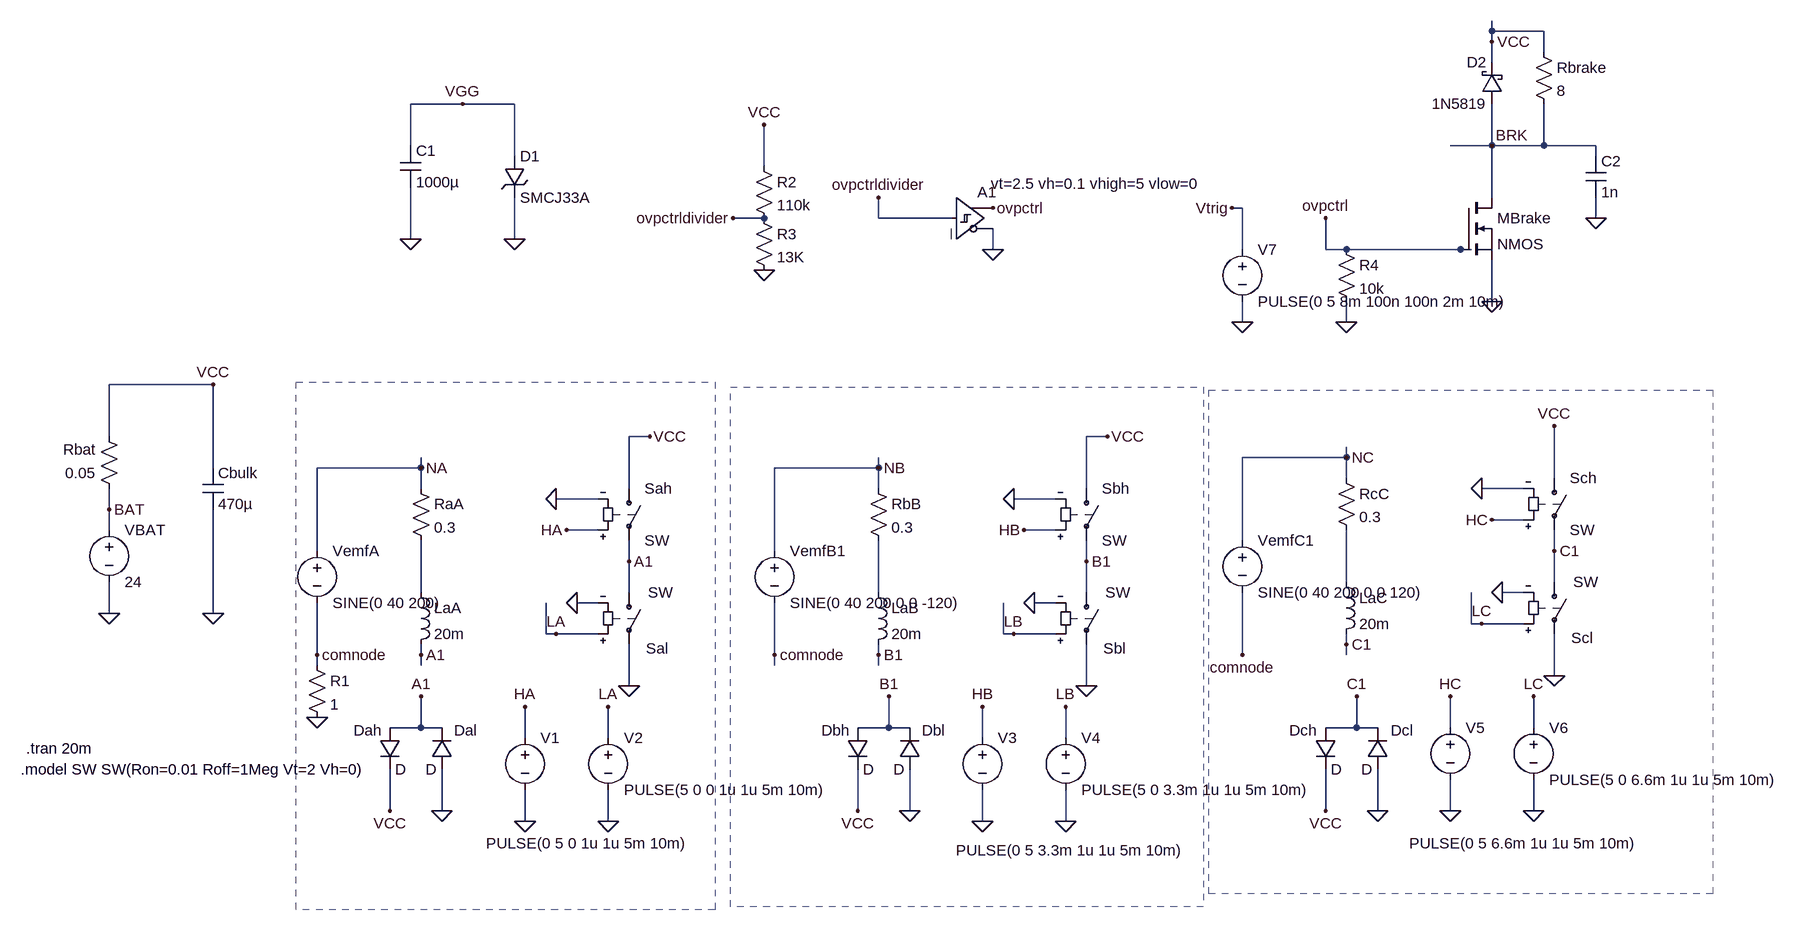
[diagram p0: schematic motor_load.asc]
motor_load.asc, the LTspice schematic file:
Version 4
SHEET 1 2236 912
WIRE 1440 -784 1440 -800
WIRE 1520 -784 1440 -784
WIRE 1440 -768 1440 -784
WIRE 1520 -752 1520 -784
WIRE 1440 -736 1440 -768
WIRE -144 -672 -224 -672
WIRE -64 -672 -144 -672
WIRE -224 -608 -224 -672
WIRE 1440 -608 1440 -672
WIRE 1440 -608 1376 -608
WIRE 1520 -608 1520 -672
WIRE 1520 -608 1440 -608
WIRE 1600 -608 1520 -608
WIRE -64 -592 -64 -672
WIRE 1600 -592 1600 -608
WIRE 320 -576 320 -640
WIRE 1440 -528 1440 -608
WIRE 1056 -512 1040 -512
WIRE 320 -496 272 -496
WIRE 496 -496 496 -528
WIRE 608 -496 496 -496
WIRE 1600 -496 1600 -528
WIRE -224 -464 -224 -544
WIRE -64 -464 -64 -528
WIRE 672 -448 672 -480
WIRE 1056 -448 1056 -512
WIRE 1184 -448 1184 -496
WIRE 1216 -448 1184 -448
WIRE 1392 -448 1216 -448
WIRE 1408 -448 1392 -448
WIRE 1440 -368 1440 -432
WIRE 1056 -336 1056 -368
WIRE 1216 -336 1216 -368
WIRE -528 -240 -688 -240
WIRE -688 -160 -688 -240
WIRE 144 -160 112 -160
WIRE 848 -160 816 -160
WIRE 1216 -128 1216 -144
WIRE 1216 -128 1056 -128
WIRE -528 -112 -528 -240
WIRE -208 -112 -208 -128
WIRE -208 -112 -368 -112
WIRE 496 -112 496 -128
WIRE 496 -112 336 -112
WIRE 1216 -96 1216 -128
WIRE 1536 -96 1536 -176
WIRE -208 -80 -208 -112
WIRE 112 -80 112 -160
WIRE 496 -80 496 -112
WIRE 816 -80 816 -160
WIRE 1488 -80 1424 -80
WIRE 64 -64 0 -64
WIRE 768 -64 704 -64
WIRE -688 -48 -688 -80
WIRE 1488 -32 1440 -32
WIRE -688 -16 -688 -48
WIRE 64 -16 16 -16
WIRE 768 -16 720 -16
WIRE 1056 0 1056 -128
WIRE -368 16 -368 -112
WIRE 336 16 336 -112
WIRE 1536 16 1536 -16
WIRE 112 32 112 0
WIRE 816 32 816 0
WIRE 1216 64 1216 -16
WIRE 1536 64 1536 16
WIRE -208 80 -208 0
WIRE 112 80 112 32
WIRE 496 80 496 0
WIRE 816 80 816 32
WIRE 1488 80 1456 80
WIRE 64 96 32 96
WIRE 768 96 736 96
WIRE -688 112 -688 64
WIRE -528 112 -528 -48
WIRE 1408 128 1408 80
WIRE 1424 128 1408 128
WIRE 1488 128 1424 128
WIRE -16 144 -16 96
WIRE 0 144 -16 144
WIRE 64 144 0 144
WIRE 688 144 688 96
WIRE 704 144 688 144
WIRE 768 144 704 144
WIRE 1216 160 1216 144
WIRE -368 176 -368 96
WIRE -208 176 -208 160
WIRE 336 176 336 96
WIRE 496 176 496 160
WIRE 1056 176 1056 80
WIRE 1216 176 1216 160
WIRE -368 192 -368 176
WIRE -208 192 -208 176
WIRE 336 192 336 176
WIRE 496 192 496 176
WIRE 1536 208 1536 144
WIRE 112 224 112 160
WIRE 816 224 816 160
WIRE -208 288 -208 240
WIRE -208 288 -256 288
WIRE -176 288 -208 288
WIRE 512 288 512 240
WIRE 512 288 464 288
WIRE 544 288 512 288
WIRE 1232 288 1232 240
WIRE 1232 288 1184 288
WIRE 1264 288 1232 288
WIRE 1376 288 1376 240
WIRE 1504 288 1504 240
WIRE -48 304 -48 256
WIRE 80 304 80 256
WIRE 656 304 656 256
WIRE 784 304 784 256
WIRE -256 416 -256 352
WIRE -176 416 -176 352
WIRE 464 416 464 352
WIRE 544 416 544 352
WIRE 1184 416 1184 352
WIRE 1264 416 1264 352
WIRE 1376 416 1376 368
WIRE 1504 416 1504 368
WIRE -48 432 -48 384
WIRE 80 432 80 384
WIRE 656 432 656 384
WIRE 784 432 784 384
FLAG -528 -240 VCC
FLAG -688 112 0
FLAG -208 176 A1
FLAG -208 -112 NA
FLAG -528 112 0
FLAG -688 -48 BAT
FLAG 144 -160 VCC
FLAG 16 -16 HA
FLAG 0 -64 0
FLAG 112 224 0
FLAG 32 96 0
FLAG 112 32 A1
FLAG 0 144 LA
FLAG -48 432 0
FLAG 80 432 0
FLAG -48 256 HA
FLAG 80 256 LA
FLAG 496 176 B1
FLAG 496 -112 NB
FLAG 848 -160 VCC
FLAG 720 -16 HB
FLAG 704 -64 0
FLAG 816 224 0
FLAG 736 96 0
FLAG 816 32 B1
FLAG 704 144 LB
FLAG 656 432 0
FLAG 784 432 0
FLAG 656 256 HB
FLAG 784 256 LB
FLAG 1216 160 C1
FLAG 1216 -128 NC
FLAG 1440 -32 HC
FLAG 1424 -80 0
FLAG 1536 208 0
FLAG 1456 80 0
FLAG 1536 16 C1
FLAG 1424 128 LC
FLAG 1376 416 0
FLAG 1504 416 0
FLAG 1376 240 HC
FLAG 1504 240 LC
FLAG 1536 -176 VCC
FLAG -368 176 comnode
FLAG 336 176 comnode
FLAG 1056 176 comnode
FLAG -368 272 0
FLAG 272 -496 ovpctrldivider
FLAG 320 -640 VCC
FLAG 320 -416 0
FLAG 672 -448 0
FLAG 496 -528 ovpctrldivider
FLAG 672 -512 ovpctrl
FLAG -224 -464 0
FLAG -64 -464 0
FLAG -144 -672 VGG
FLAG 1440 -368 0
FLAG 1216 -336 0
FLAG 1440 -608 BRK
FLAG 1600 -496 0
FLAG 1440 -768 VCC
FLAG -208 240 A1
FLAG -256 416 VCC
FLAG -176 416 0
FLAG 512 240 B1
FLAG 464 416 VCC
FLAG 544 416 0
FLAG 1232 240 C1
FLAG 1184 416 VCC
FLAG 1264 416 0
FLAG 1040 -512 Vtrig
FLAG 1056 -336 0
FLAG 1184 -496 ovpctrl
SYMBOL Ind -224 64 R0
SYMATTR InstName LaA
SYMATTR Value 20m
SYMBOL Voltage -688 -32 R0
SYMATTR InstName VBAT
SYMATTR Value 24
SYMBOL Res -224 -96 R0
SYMATTR InstName RaA
SYMATTR Value 0.3
SYMBOL Res -672 -64 R180
WINDOW 0 36 76 Left 2
WINDOW 3 36 40 Left 2
SYMATTR InstName Rbat
SYMATTR Value 0.05
SYMBOL Cap -544 -112 R0
SYMATTR InstName Cbulk
SYMATTR Value 470µ
SYMBOL Voltage -368 0 R0
SYMATTR InstName VemfA
SYMATTR Value SINE(0 40 200)
SYMBOL sw 112 -96 R0
SYMATTR InstName Sah
SYMBOL sw 112 64 R0
WINDOW 0 26 102 Left 2
WINDOW 3 29 16 Left 2
SYMATTR InstName Sal
SYMBOL Voltage -48 288 R0
WINDOW 3 -60 178 Left 2
SYMATTR Value PULSE(0 5 0 1u 1u 5m 10m)
SYMATTR InstName V1
SYMBOL Voltage 80 288 R0
SYMATTR InstName V2
SYMATTR Value PULSE(5 0 0 1u 1u 5m 10m)
SYMBOL Ind 480 64 R0
SYMATTR InstName LaB
SYMATTR Value 20m
SYMBOL Res 480 -96 R0
SYMATTR InstName RbB
SYMATTR Value 0.3
SYMBOL sw 816 -96 R0
SYMATTR InstName Sbh
SYMBOL sw 816 64 R0
WINDOW 0 26 102 Left 2
WINDOW 3 29 16 Left 2
SYMATTR InstName Sbl
SYMBOL Voltage 656 288 R0
WINDOW 3 -41 189 Left 2
SYMATTR Value PULSE(0 5 3.3m 1u 1u 5m 10m)
SYMATTR InstName V3
SYMBOL Voltage 784 288 R0
SYMATTR InstName V4
SYMATTR Value PULSE(5 0 3.3m 1u 1u 5m 10m)
SYMBOL Ind 1200 48 R0
SYMATTR InstName LaC
SYMATTR Value 20m
SYMBOL Res 1200 -112 R0
SYMATTR InstName RcC
SYMATTR Value 0.3
SYMBOL sw 1536 -112 R0
SYMATTR InstName Sch
SYMBOL sw 1536 48 R0
WINDOW 0 26 102 Left 2
WINDOW 3 29 16 Left 2
SYMATTR InstName Scl
SYMBOL Voltage 1376 272 R0
WINDOW 3 -63 194 Left 2
SYMATTR Value PULSE(0 5 6.6m 1u 1u 5m 10m)
SYMATTR InstName V5
SYMBOL Voltage 1504 272 R0
SYMATTR InstName V6
SYMATTR Value PULSE(5 0 6.6m 1u 1u 5m 10m)
SYMBOL Voltage 336 0 R0
SYMATTR InstName VemfB1
SYMATTR Value SINE(0 40 200 0 0 -120)
SYMBOL Voltage 1056 -16 R0
SYMATTR InstName VemfC1
SYMATTR Value SINE(0 40 200 0 0 120)
SYMBOL Res -384 176 R0
SYMATTR InstName R1
SYMATTR Value 1
SYMBOL res 304 -592 R0
SYMATTR InstName R2
SYMATTR Value 110k
SYMBOL res 304 -512 R0
SYMATTR InstName R3
SYMATTR Value 13K
SYMBOL schmitt 608 -560 R0
WINDOW 3 61 11 Left 2
SYMATTR Value vt=2.5 vh=0.1 vhigh=5 vlow=0
SYMATTR InstName A1
SYMBOL TVSdiode -80 -592 R0
SYMATTR InstName D1
SYMATTR Value SMCJ33A
SYMATTR Description Diode
SYMATTR Type diode
SYMBOL cap -240 -608 R0
SYMATTR InstName C1
SYMATTR Value 1000µ
SYMBOL nmos 1392 -528 R0
SYMATTR InstName MBrake
SYMBOL res 1200 -464 R0
SYMATTR InstName R4
SYMATTR Value 10k
SYMBOL Cap 1584 -592 R0
SYMATTR InstName C2
SYMATTR Value 1n
SYMBOL Diode -272 288 R0
WINDOW 0 -40 4 Left 2
SYMATTR InstName Dah
SYMBOL Diode -160 352 R180
WINDOW 0 -39 60 Left 2
WINDOW 3 24 0 Left 2
SYMATTR InstName Dal
SYMBOL Diode 448 288 R0
WINDOW 0 -40 4 Left 2
SYMATTR InstName Dbh
SYMBOL Diode 560 352 R180
WINDOW 0 -39 60 Left 2
WINDOW 3 24 0 Left 2
SYMATTR InstName Dbl
SYMBOL Diode 1168 288 R0
WINDOW 0 -40 4 Left 2
SYMATTR InstName Dch
SYMBOL Diode 1280 352 R180
WINDOW 0 -39 60 Left 2
WINDOW 3 24 0 Left 2
SYMATTR InstName Dcl
SYMBOL Voltage 1056 -464 R0
SYMATTR InstName V7
SYMATTR Value PULSE(0 5 8m 100n 100n 2m 10m)
SYMBOL schottky 1456 -672 R180
WINDOW 0 24 64 Left 2
WINDOW 3 24 0 Left 2
SYMATTR InstName D2
SYMATTR Value 1N5819
SYMATTR Description Diode
SYMATTR Type diode
SYMBOL Res 1504 -768 R0
SYMATTR InstName Rbrake
SYMATTR Value 8
TEXT -816 320 Left 2 !.tran 20m
TEXT -824 352 Left 2 !.model SW SW(Ron=0.01 Roff=1Meg Vt=2 Vh=0)
RECTANGLE Normal 268 -236 996 564 3
RECTANGLE Normal 1004 -232 1780 544 2
RECTANGLE Normal -400 -244 244 568 2

The netlist it stands for:
* motor_load.asc
LaA N002 A1 20m
VBAT BAT 0 24
RaA NA N002 0.3
Rbat BAT VCC 0.05
Cbulk VCC 0 470µ
VemfA NA comnode SINE(0 40 200)
Sah VCC A1 HA 0 SW
Sal A1 0 LA 0 SW
V1 HA 0 PULSE(0 5 0 1u 1u 5m 10m)
V2 LA 0 PULSE(5 0 0 1u 1u 5m 10m)
LaB N003 B1 20m
RbB NB N003 0.3
Sbh VCC B1 HB 0 SW
Sbl B1 0 LB 0 SW
V3 HB 0 PULSE(0 5 3.3m 1u 1u 5m 10m)
V4 LB 0 PULSE(5 0 3.3m 1u 1u 5m 10m)
LaC N001 C1 20m
RcC NC N001 0.3
Sch VCC C1 HC 0 SW
Scl C1 0 LC 0 SW
V5 HC 0 PULSE(0 5 6.6m 1u 1u 5m 10m)
V6 LC 0 PULSE(5 0 6.6m 1u 1u 5m 10m)
VemfB1 NB comnode SINE(0 40 200 0 0 -120)
VemfC1 NC comnode SINE(0 40 200 0 0 120)
R1 comnode 0 1
R2 VCC ovpctrldivider 110k
R3 ovpctrldivider 0 13K
A1 ovpctrldivider 0 0 0 0 0 ovpctrl 0 SCHMITT vt=2.5 vh=0.1 vhigh=5 vlow=0
D1 VGG 0 SMCJ33A
C1 VGG 0 1000µ
MBrake BRK ovpctrl 0 0 NMOS
R4 ovpctrl 0 10k
C2 BRK 0 1n
Dah A1 VCC D
Dal 0 A1 D
Dbh B1 VCC D
Dbl 0 B1 D
Dch C1 VCC D
Dcl 0 C1 D
V7 Vtrig 0 PULSE(0 5 8m 100n 100n 2m 10m)
D2 BRK VCC 1N5819
Rbrake VCC BRK 8
.model D D
.lib standard.dio
.model NMOS NMOS
.model PMOS PMOS
.lib standard.mos
.tran 20m
.model SW SW(Ron=0.01 Roff=1Meg Vt=2 Vh=0)
.backanno
.end